# Altium project GameBoard_V1I1.PrjPcb (part 11 of 20)

## Sheet [30] - PWR PMIC.SchDoc
size A2; DocumentNumber: 29; SheetNumber: 29; SheetTotal: 32
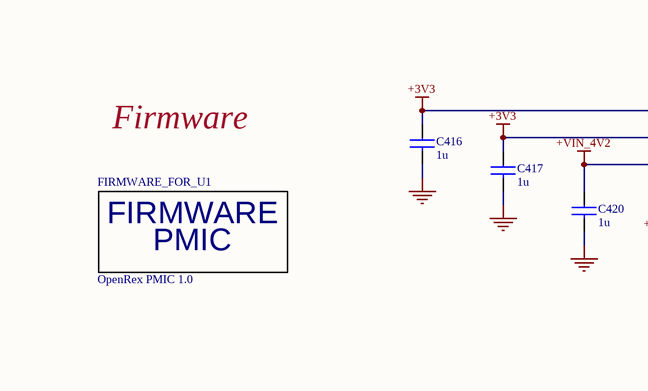
[diagram p62: [30] - PWR PMIC.SchDoc, top left]
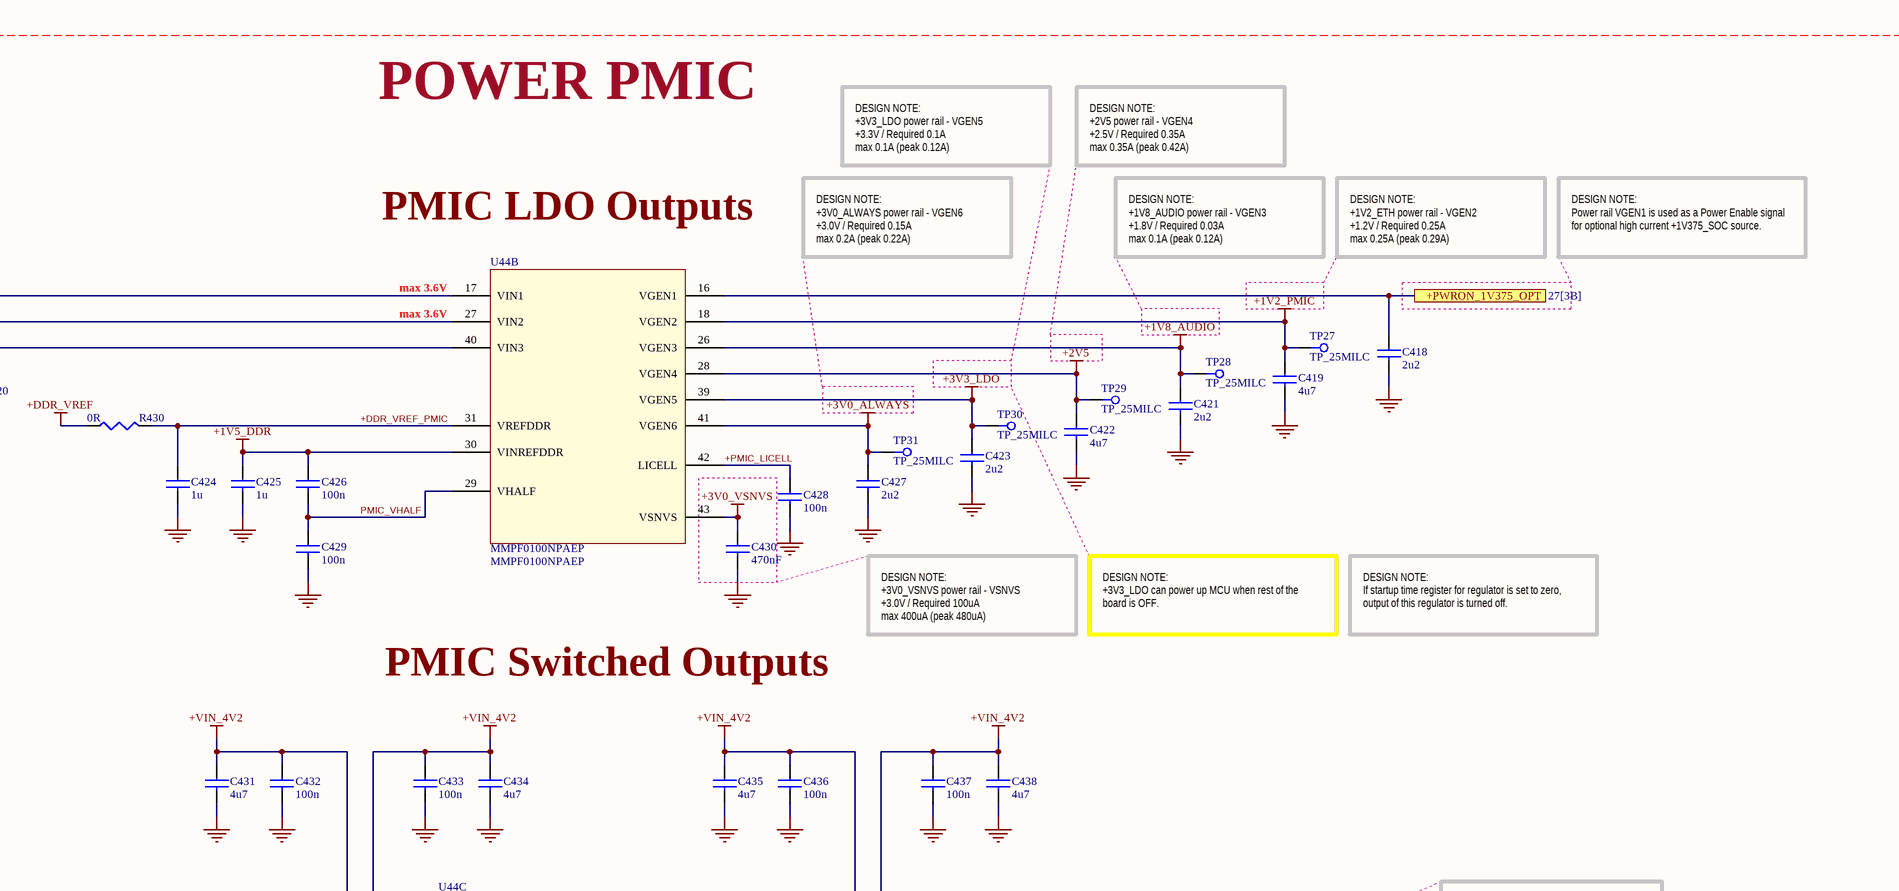
[diagram p63: [30] - PWR PMIC.SchDoc, top right]
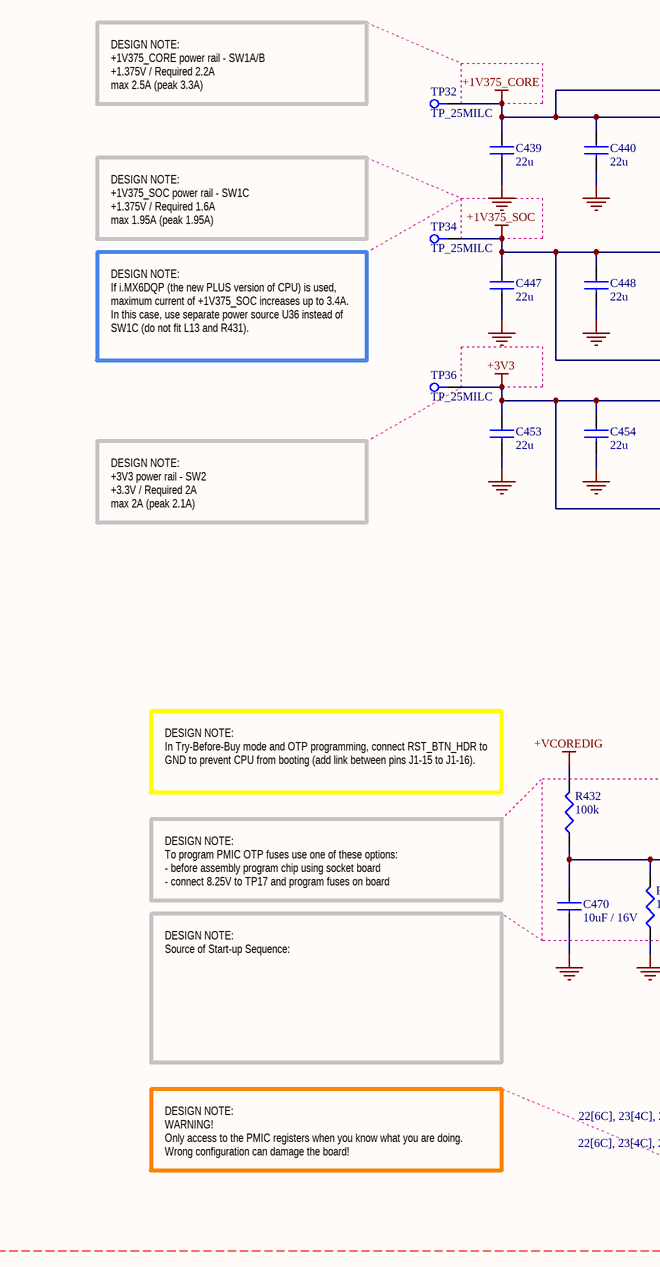
[diagram p64: [30] - PWR PMIC.SchDoc, bottom left]
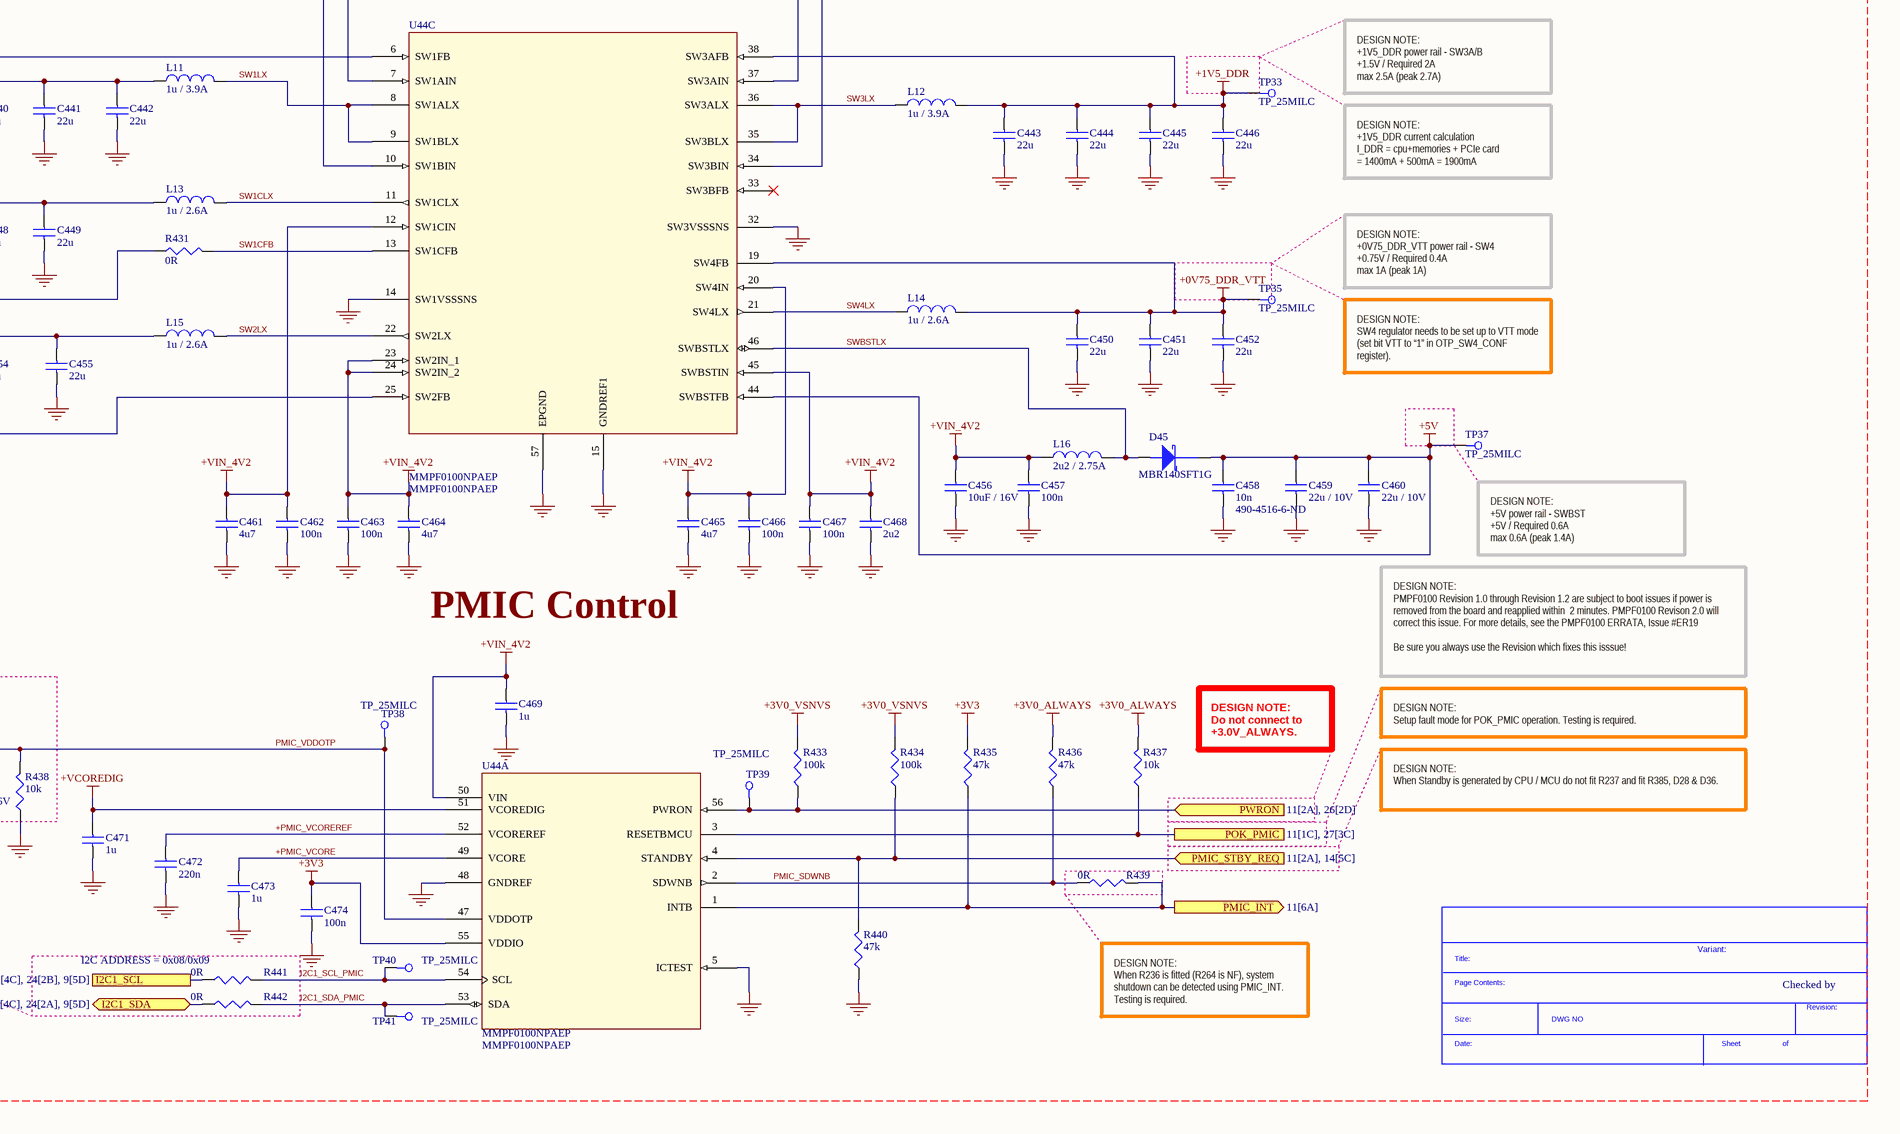
[diagram p65: [30] - PWR PMIC.SchDoc, bottom right]

### Parts
(Parts that share a designator on the sheet are numbered #1, #2 ... from top to bottom, then left to right.)
*#21  SDTitleBlock  (value not drawn)  (graphical)
C416  1u  [C0402]
C417  1u  [C0402]
C418  2u2  [C0402]
C419  4u7  [C0402]
C420  1u  [C0402]
C421  2u2  [C0402]
C422  4u7  [C0402]
C423  2u2  [C0402]
C424  1u  [C0402]
C425  1u  [C0402]
C426  100n  [C0402]
C427  2u2  [C0402]
C428  100n  [C0402]
C429  100n  [C0402]
C430  470nF  [C0402]
C431  4u7  [C0402]
C432  100n  [C0402]
C433  100n  [C0402]
C434  4u7  [C0402]
C435  4u7  [C0402]
C436  100n  [C0402]
C437  100n  [C0402]
C438  4u7  [C0402]
C439  22u  [C0603]
C440  22u  [C0603]
C441  22u  [C0603]
C442  22u  [C0603]
C443  22u  [C0603]
C444  22u  [C0603]
C445  22u  [C0603]
C446  22u  [C0603]
C447  22u  [C0603]
C448  22u  [C0603]
C449  22u  [C0603]
C450  22u  [C0603]
C451  22u  [C0603]
C452  22u  [C0603]
C453  22u  [C0603]
C454  22u  [C0603]
C455  22u  [C0603]
C456  10uF / 16V  [C0805]
C457  100n  [C0402]
C458  10n  Supplier Part Number 2: 490-4516-6-ND  [C0402]
C459  22u / 10V  [C0603]
C460  22u / 10V  [C0603]
C461  4u7  [C0402]
C462  100n  [C0402]
C463  100n  [C0402]
C464  4u7  [C0402]
C465  4u7  [C0402]
C466  100n  [C0402]
C467  100n  [C0402]
C468  2u2  [C0402]
C469  1u  [C0402]
C470  10uF / 16V  [C0805]
C471  1u  [C0402]
C472  220n  [C0402]
C473  1u  [C0402]
C474  100n  [C0402]
D45  MBR140SFT1G  [SOD-123FL]
FIRMWARE_FOR_U1  OpenRex PMIC 1.0  (mechanical)
L11  1u / 3.9A  [IHLP_118MILX144MIL]
L12  1u / 3.9A  [IHLP_118MILX144MIL]
L13  1u / 2.6A  [IFSC_79MILX98MIL]
L14  1u / 2.6A  [IFSC_79MILX98MIL]
L15  1u / 2.6A  [IFSC_79MILX98MIL]
L16  2u2 / 2.75A  [IHLP_160MILX175MIL]
R430  0R  [R0402]
R431  0R  [R0402]
R432  100k  [R0402]
R433  100k  [R0402]
R434  100k  [R0402]
R435  47k  [R0402]
R436  47k  [R0402]
R437  10k  [R0402]
R438  10k  [R0402]
R439  0R  [R0402]
R440  47k  [R0402]
R441  0R  [R0402]
R442  0R  [R0402]
TP27  TP_25MILC  [TP_25C]  (no BOM)
TP28  TP_25MILC  [TP_25C]  (no BOM)
TP29  TP_25MILC  [TP_25C]  (no BOM)
TP30  TP_25MILC  [TP_25C]  (no BOM)
TP31  TP_25MILC  [TP_25C]  (no BOM)
TP32  TP_25MILC  [TP_25C]  (no BOM)
TP33  TP_25MILC  [TP_25C]  (no BOM)
TP34  TP_25MILC  [TP_25C]  (no BOM)
TP35  TP_25MILC  [TP_25C]  (no BOM)
TP36  TP_25MILC  [TP_25C]  (no BOM)
TP37  TP_25MILC  [TP_25C]  (no BOM)
TP38  TP_25MILC  [TP_25C]  (no BOM)
TP39  TP_25MILC  [TP_25C]  (no BOM)
TP40  TP_25MILC  [TP_25C]  (no BOM)
TP41  TP_25MILC  [TP_25C]  (no BOM)
U44  MMPF0100NPAEP  [56-VFQFN EP]  (parts A,B,C of 3)

### Blocks framed on the sheet
I2C ADDRESS = 0x08/0x09: R441 R442

### Ports
+PWRON_1V375_OPT (see 27[3B]), I2C1_SCL (see 22[6C], 23[4C], 24[2B], 9[5D]), I2C1_SDA (bidir, see 22[6C], 23[4C], 24[2A], 9[5D]), PMIC_INT (out, see 11[6A]), PMIC_STBY_REQ (in, see 11[2A], 14[5C]), POK_PMIC (see 11[1C], 27[3C]), PWRON (in, see 11[2A], 26[2D])

### Nets
+0V75_DDR_VTT: C450.1 C451.1 C452.1 L14.2 TP35.1 U44.19(SW4FB)
+1V2_PMIC: C419.1 TP27.1 U44.18(VGEN2)
+1V5_DDR: C425.1 C426.1 C443.1 C444.1 C445.1 C446.1 L12.2 TP33.1 U44.30(VINREFDDR) U44.38(SW3AFB)
+1V8_AUDIO: C421.1 TP28.1 U44.26(VGEN3)
+1V375_CORE: C439.1 C440.1 C441.1 C442.1 L11.2 TP32.1 U44.6(SW1FB)
+1V375_SOC: C447.1 C448.1 C449.1 L13.1 R431.1 TP34.1
+2V5: C422.1 TP29.1 U44.28(VGEN4)
+3V0_ALWAYS: C427.1 R436.2 R437.2 TP31.1 U44.41(VGEN6)
+3V0_VSNVS: C430.1 R433.2 R434.2 U44.43(VSNVS)
+3V3: C416.1 C417.1 C453.1 C454.1 C455.1 C474.1 L15.2 R435.2 TP36.1 U44.17(VIN1) U44.25(SW2FB) U44.27(VIN2) U44.55(VDDIO)
+3V3_LDO: C423.1 TP30.1 U44.39(VGEN5)
+5V: C458.1 C459.1 C460.1 D45.1(Cathode) TP37.1 U44.44(SWBSTFB)
+DDR_VREF: R430.1
+VCOREDIG: C471.1 R432.2 U44.51(VCOREDIG)
+VIN_4V2: C420.1 C431.1 C432.1 C433.1 C434.1 C435.1 C436.1 C437.1 C438.1 C456.1 C457.1 C461.1 C462.1 C463.1 C464.1 C465.1 C466.1 C467.1 C468.1 C469.1 L16.1 U44.7(SW1AIN) U44.10(SW1BIN) U44.12(SW1CIN) U44.20(SW4IN) U44.23(SW2IN_1) U44.24(SW2IN_2) U44.34(SW3BIN) U44.37(SW3AIN) U44.40(VIN3) U44.45(SWBSTIN) U44.50(VIN)
GND: C416.2 C417.2 C418.2 C419.2 C420.2 C421.2 C422.2 C423.2 C424.2 C425.2 C427.2 C428.2 C429.2 C430.2 C431.2 C432.2 C433.2 C434.2 C435.2 C436.2 C437.2 C438.2 C439.2 C440.2 C441.2 C442.2 C443.2 C444.2 C445.2 C446.2 C447.2 C448.2 C449.2 C450.2 C451.2 C452.2 C453.2 C454.2 C455.2 C456.2 C457.2 C458.2 C459.2 C460.2 C461.2 C462.2 C463.2 C464.2 C465.2 C466.2 C467.2 C468.2 C469.2 C470.2 C471.2 C472.2 C473.2 C474.2 R438.1 R440.1 U44.5(ICTEST) U44.14(SW1VSSSNS) U44.15(GNDREF1) U44.32(SW3VSSSNS) U44.48(GNDREF) U44.57(EPGND)
+DDR_VREF_PMIC: C424.1 R430.2 U44.31(VREFDDR)
+PMIC_LICELL: C428.1 U44.42(LICELL)
+PMIC_VCORE: C473.1 U44.49(VCORE)
+PMIC_VCOREREF: C472.1 U44.52(VCOREREF)
+PWRON_1V375_OPT: C418.1 U44.16(VGEN1) ; port +PWRON_1V375_OPT
I2C1_SCL: R441.1 ; port I2C1_SCL
I2C1_SCL_PMIC: R441.2 TP40.1 U44.54(SCL)
I2C1_SDA: R442.1 ; port I2C1_SDA
I2C1_SDA_PMIC: R442.2 TP41.1 U44.53(SDA)
PMIC_INT: R435.1 R439.2 U44.1(INTB) ; port PMIC_INT
PMIC_SDWNB: R436.1 R439.1 U44.2(SDWNB)
PMIC_STBY_REQ: R434.1 R440.2 U44.4(STANDBY) ; port PMIC_STBY_REQ
PMIC_VDDOTP: C470.1 R432.1 R438.2 TP38.1 U44.47(VDDOTP)
PMIC_VHALF: C426.2 C429.1 U44.29(VHALF)
POK_PMIC: R437.1 U44.3(RESETBMCU) ; port POK_PMIC
PWRON: R433.1 TP39.1 U44.56(PWRON) ; port PWRON
SW1CFB: R431.2 U44.13(SW1CFB)
SW1CLX: L13.2 U44.11(SW1CLX)
SW1LX: L11.1 U44.8(SW1ALX) U44.9(SW1BLX)
SW2LX: L15.1 U44.22(SW2LX)
SW3LX: L12.1 U44.35(SW3BLX) U44.36(SW3ALX)
SW4LX: L14.1 U44.21(SW4LX)
SWBSTLX: D45.2(Anode) L16.2 U44.46(SWBSTLX)

Not connected (* = marked no-connect by the designer): U44 33(SW3BFB)*

### Layout directives
net class [29] - PWR PMIC: +0V75_DDR_VTT, +1V2_PMIC, +1V5_DDR, +1V8_AUDIO, +1V375_CORE, +1V375_SOC, +2V5, +3V0_ALWAYS, +3V0_VSNVS, +3V3, +3V3_LDO, +5V, +DDR_VREF, +DDR_VREF_PMIC, +PMIC_LICELL, +PMIC_VCORE, +PMIC_VCOREREF, +VCOREDIG, +VIN_4V2, GND, I2C1_SCL_PMIC, I2C1_SDA_PMIC, PMIC_SDWNB, PMIC_VDDOTP, PMIC_VHALF, SW1CFB, SW1CLX, SW1LX, SW2LX, SW3LX, SW4LX, SWBSTLX

### Notes on the sheet
- POWER PMIC
- DESIGN NOTE:
  +3V3_LDO power rail - VGEN5
  +3.3V / Required 0.1A
  max 0.1A (peak 0.12A)
- DESIGN NOTE:
  +2V5 power rail - VGEN4
  +2.5V / Required 0.35A
  max 0.35A (peak 0.42A)
- PMIC LDO Outputs
- DESIGN NOTE:
  +3V0_ALWAYS power rail - VGEN6
  +3.0V / Required 0.15A
  max 0.2A (peak 0.22A)
- DESIGN NOTE:
  +1V8_AUDIO power rail - VGEN3
  +1.8V / Required 0.03A
  max 0.1A (peak 0.12A)
- DESIGN NOTE:
  +1V2_ETH power rail - VGEN2
  +1.2V / Required 0.25A
  max 0.25A (peak 0.29A)
- (near U44) max 3.6V
- DESIGN NOTE:
  Power rail VGEN1 is used as a Power Enable signal for optional high current +1V375_SOC source.
- Firmware
- DESIGN NOTE:
  +3V0_VSNVS power rail - VSNVS
  +3.0V / Required 100uA
  max 400uA (peak 480uA)
- DESIGN NOTE:
  +3V3_LDO can power up MCU when rest of the board is OFF.
- DESIGN NOTE:
  If startup time register for regulator is set to zero, output of this regulator is turned off.
- PMIC Switched Outputs
- DESIGN NOTE:
  +1V375_CORE power rail - SW1A/B
  +1.375V / Required 2.2A
  max 2.5A (peak 3.3A)
- DESIGN NOTE:
  +1V5_DDR power rail - SW3A/B
  +1.5V / Required 2A
  max 2.5A (peak 2.7A)
- DESIGN NOTE:
  +1V375_SOC power rail - SW1C
  +1.375V / Required 1.6A
  max 1.95A (peak 1.95A)
- DESIGN NOTE:
  +1V5_DDR current calculation
  I_DDR = cpu+memories + PCIe card
  = 1400mA + 500mA = 1900mA
- DESIGN NOTE:
  +0V75_DDR_VTT power rail - SW4
  +0.75V / Required 0.4A
  max 1A (peak 1A)
- DESIGN NOTE:
  If i.MX6DQP (the new PLUS version of CPU) is used, maximum current of +1V375_SOC increases up to 3.4A.
  In this case, use separate power source U36 instead of SW1C (do not fit L13 and R431).
- DESIGN NOTE:
  SW4 regulator needs to be set up to VTT mode (set bit VTT to “1” in OTP_SW4_CONF register).
- DESIGN NOTE:
  +3V3 power rail - SW2
  +3.3V / Required 2A
  max 2A (peak 2.1A)
- DESIGN NOTE:
  +5V power rail - SWBST
  +5V / Required 0.6A
  max 0.6A (peak 1.4A)
- PMIC Control
- DESIGN NOTE:
  In Try-Before-Buy mode and OTP programming, connect RST_BTN_HDR to GND to prevent CPU from booting (add link between pins J1-15 to J1-16).
- DESIGN NOTE:
  PMPF0100 Revision 1.0 through Revision 1.2 are subject to boot issues if power is removed from the board and reapplied within  2 minutes. PMPF0100 Revison 2.0 will correct this issue. For more details, see the PMPF0100 ERRATA, Issue #ER19
  Be sure you always use the Revision which fixes this isssue!
- DESIGN NOTE:
  Do not connect to +3.0V_ALWAYS.
- DESIGN NOTE:
  Setup fault mode for POK_PMIC operation. Testing is required.
- DESIGN NOTE:
  To program PMIC OTP fuses use one of these options:
  - before assembly program chip using socket board
  - connect 8.25V to TP17 and program fuses on board
- DESIGN NOTE:
  When Standby is generated by CPU / MCU do not fit R237 and fit R385, D28 & D36.
- DESIGN NOTE:
  Source of Start-up Sequence:
- Variant:
- Checked by
- DESIGN NOTE:
  WARNING!
  Only access to the PMIC registers when you know what you are doing. Wrong configuration can damage the board!
- DESIGN NOTE:
  When R236 is fitted (R264 is NF), system shutdown can be detected using PMIC_INT. Testing is required.
- (in symbol FIRMWARE_OpenRex_PMIC_1.0) FIRMWARE; PMIC
- (in symbol SDTitleBlock) Title:; Page Contents:; Revision:; Size:; DWG NO; Date:; Sheet; of

### Library data of the parts
C416 C417 C420 C424 C425 C469 C471 C473 = C1005X5R1C105K: CAP CER 1.0UF 16V X5R 0402; Manufacturer: TDK Corporation; Capacitance: 1.0µF; Value: 1uF; .Checked PCB: used; Tolerance: ±10%; Category: Capacitors; Supplier Part Number: 445-4978-1-ND; Manufacturer Part Number: C1005X5R1C105K; Operating Temperature: -55°C ~ 85°C; Package / Case: 0402 (1005 Metric); Price 1k [$]: 0.02080; .Checked SCH: used; Voltage - Rated: 16V; Supplier: Digikey; Supplier 1: Digi-Key; Supplier Part Number 1: 445-4978-1-ND; RoHS: RoHS Compliant; Stock 1: 341010; Pricing 1: 1=0.24, 10=0.16, 100=0.064, 250=0.046, 500=0.0328, 1000=0.024 (USD); Temperature Coefficient: X5R; Mounting Type: Surface Mount, MLCC; Applications: General Purpose; Ratings: -; Size / Dimension: 0.039" L x 0.020" W (1.00mm x 0.50mm); Height - Seated (Max): -; Thickness (Max): 0.022" (0.55mm); Lead Spacing: -; Features: -; Packaging: Cut Tape (CT); Lead Style: -; ComponentLink1URL: http://www.tdk.co.jp/tefe02/e412_c.pdf; ComponentLink1Description: http://www.tdk.co.jp/tefe02/e412_c.pdf; Supplier 2: Digi-Key; Supplier Part Number 2: 445-13181-1-ND
C418 C421 C423 C427 C468 = C1005X5R1A225K: CAP CER 2.2UF 10V 10% X5R 0402; Manufacturer: TDK Corporation; Capacitance: 2.2µF; .Checked PCB: used; Supplier 1: Digi-Key; Supplier Part Number 1: 445-7392-1-ND; Manufacturer Part Number: C1005X5R1A225K; RoHS: RoHS Compliant; Category: Capacitors; Stock 1: 22891; Pricing 1: 1=0.42, 10=0.332, 100=0.2, 250=0.15, 500=0.128, 1000=0.1 (USD); Voltage - Rated: 10V; Tolerance: ±10%; Temperature Coefficient: X5R; Mounting Type: Surface Mount, MLCC; Operating Temperature: -55°C ~ 85°C; Applications: General Purpose; Ratings: -; Package / Case: 0402 (1005 Metric); Size / Dimension: 0.039" L x 0.020" W (1.00mm x 0.50mm); Height - Seated (Max): -; Thickness (Max): 0.022" (0.55mm); Lead Spacing: -; Features: -; Packaging: Cut Tape (CT); Lead Style: -; ComponentLink1URL: http://www.tdk.com/pdf/general_B11.pdf; ComponentLink1Description: http://www.tdk.com/pdf/general_B11.pdf; .Checked SCH: used; Supplier 2: Digi-Key; Supplier Part Number 2: 445-9090-1-ND
C419 C422 C431 C434 C435 C438 C461 C464 C465 = C1005X5R1A475M: CAP CER 4.7UF 10V 20% X5R 0402; Manufacturer: TDK Corporation; Capacitance: 4.7µF; .Checked PCB: used; Supplier 1: Digi-Key; Supplier Part Number 1: 445-8023-1-ND; Manufacturer Part Number: C1005X5R1A475M; RoHS: RoHS Compliant; Category: Capacitors; Stock 1: 10140; Pricing 1: 1=0.53, 10=0.415, 100=0.25, 250=0.18752, 500=0.16, 1000=0.125, 5000=0.095 (USD); Voltage - Rated: 10V; Tolerance: ±20%; Temperature Coefficient: X5R; Mounting Type: Surface Mount, MLCC; Operating Temperature: -55°C ~ 85°C; Applications: General Purpose; Ratings: -; Package / Case: 0402 (1005 Metric); Size / Dimension: 0.039" L x 0.020" W (1.00mm x 0.50mm); Height - Seated (Max): -; Thickness (Max): -; Lead Spacing: -; Features: -; Packaging: Cut Tape (CT); Lead Style: -; ComponentLink1URL: http://www.tdk.com/pdf/general_B11.pdf; ComponentLink1Description: http://www.tdk.com/pdf/general_B11.pdf; .Checked SCH: used
C426 C428 C429 C432 C433 C436 C437 C457 C462 C463 C466 C467 C474 = C1005X5R1H104K: CAP CER .10UF 50V X5R 10% 0402; Manufacturer: TDK Corporation; Capacitance: 0.1µF; Value: 100nF; .Checked PCB: used; Category: Capacitors; Supplier Part Number: 445-5942-1-ND; Manufacturer Part Number: C1005X5R1H104K; Operating Temperature: -55°C ~ 85°C; Package / Case: 0402 (1005 Metric); Price 1k [$]: 0.02340; .Checked SCH: used; Voltage - Rated: 50V; Supplier: Digikey; Supplier 1: Digi-Key; Supplier Part Number 1: 445-5942-1-ND; RoHS: RoHS Compliant; Stock 1: 106926; Pricing 1: 1=0.27, 10=0.18, 100=0.072, 250=0.05176, 500=0.0369, 1000=0.027 (USD); Tolerance: ±10%; Temperature Coefficient: X5R; Mounting Type: Surface Mount, MLCC; Applications: General Purpose; Ratings: -; Size / Dimension: 0.039" L x 0.020" W (1.00mm x 0.50mm); Height - Seated (Max): -; Thickness (Max): 0.022" (0.55mm); Lead Spacing: -; Features: -; Packaging: Cut Tape (CT); Lead Style: -; ComponentLink1URL: http://www.tdk.co.jp/tefe02/e412_c.pdf; ComponentLink1Description: http://www.tdk.co.jp/tefe02/e412_c.pdf; Supplier 2: Digi-Key; Supplier Part Number 2: 311-1697-6-ND
C430 = C1005X5R1C474K: CAP CER .47UF 16V X5R 0402; Manufacturer: TDK Corporation; Capacitance: 0.47µF; .Checked PCB: used; Tolerance: ±10%; Category: Capacitors; Supplier Part Number: 445-4976-1-ND; Manufacturer Part Number: C1005X5R1C474K; Operating Temperature: -55°C ~ 85°C; Package / Case: 0402 (1005 Metric); Price 1k [$]: 0.02400; Value: 470nF; .Checked SCH: used; Voltage - Rated: 16V; Supplier: Digikey; Supplier 1: Digi-Key; Supplier Part Number 1: 445-4976-1-ND; RoHS: RoHS Compliant; Stock 1: 141502; Pricing 1: 1=0.24, 10=0.16, 100=0.064, 250=0.046, 500=0.0328, 1000=0.024 (USD); Temperature Coefficient: X5R; Mounting Type: Surface Mount, MLCC; Applications: General Purpose; Ratings: -; Size / Dimension: 0.039" L x 0.020" W (1.00mm x 0.50mm); Height - Seated (Max): -; Thickness (Max): 0.022" (0.55mm); Lead Spacing: -; Features: -; Packaging: Cut Tape (CT); Lead Style: -; ComponentLink1URL: http://www.tdk.co.jp/tefe02/e412_c.pdf; ComponentLink1Description: http://www.tdk.co.jp/tefe02/e412_c.pdf; Supplier 2: Digi-Key; Supplier Part Number 2: 1276-1173-6-ND
C439-C452 = GRM188R60G226MEA0L: CAP CER 22UF 4V 20% X5R 0603; Manufacturer: Murata Electronics North America; Capacitance: 22µF; .Checked PCB: used; .Creator: MM; Supplier 1: Digi-Key; Supplier Part Number 1: 490-5526-1-ND; Manufacturer Part Number: GRM188R60G226MEA0L; RoHS: RoHS Compliant; Category: Capacitors; Stock 1: 5760; Pricing 1: 1=0.79, 10=0.663, 50=0.4752, 100=0.4158, 250=0.32672, 500=0.297, 1000=0.2376 (USD); Voltage - Rated: 4V; Tolerance: ±20%; Temperature Coefficient: X5R; Mounting Type: Surface Mount, MLCC; Operating Temperature: -55°C ~ 85°C; Applications: General Purpose; Ratings: -; Package / Case: 0603 (1608 Metric); Size / Dimension: 0.063" L x 0.031" W (1.60mm x 0.80mm); Height - Seated (Max): -; Thickness (Max): 0.035" (0.90mm); Lead Spacing: -; Features: -; Packaging: Cut Tape (CT); Lead Style: -; ComponentLink1URL: http://www.murata.com/products/catalog/pdf/c02e.pdf; ComponentLink1Description: http://www.murata.com/products/catalog/pdf/c02e.pdf; .Checked SCH: used
C453-C455 = C1608X5R0J226M080AC: CAP CER 22UF 6.3V 20% X5R 0603; Manufacturer: TDK Corporation; Capacitance: 22µF; .Creator: MM; .Checked PCB: used; Supplier 1: Digi-Key; Manufacturer Part Number: C1608X5R0J226M080AC; RoHS: RoHS Compliant; Category: Capacitors; Stock 1: 593047; Pricing 1: 1=0.39, 10=0.343, 100=0.1714, 250=0.13708, 500=0.12484, 1000=0.1104 (USD); Packaging: Cut Tape (CT); Tolerance: ±20%; Voltage - Rated: 6.3V; Temperature Coefficient: X5R; Mounting Type: Surface Mount, MLCC; Operating Temperature: -55°C ~ 85°C; Applications: General Purpose; Ratings: -; Package / Case: 0603 (1608 Metric); Size / Dimension: 0.063" L x 0.031" W (1.60mm x 0.80mm); Height - Seated (Max): -; Thickness (Max): 0.039" (1.00mm); Lead Spacing: -; Features: -; Lead Style: -; ComponentLink1URL: http://product.tdk.com/en/catalog/datasheets/mlcc_commercial_general_en.pdf; ComponentLink1Description: http://product.tdk.com/en/catalog/datasheets/mlcc_commercial_general_en.pdf; Supplier Part Number 1: 445-8028-1-ND; .Checked SCH: used
C456 C470 = C2012X5R1C106M: CAP CER 10UF 16V 20% X5R 0805; Manufacturer: TDK Corporation; Manufacturer Part Number: C2012X5R1C106M/1.25; Capacitance: 10µF; .Checked PCB: used; Supplier 1: Digi-Key; Supplier Part Number 1: 445-5984-1-ND; RoHS: RoHS Compliant; Category: Capacitors; Voltage - Rated: 16V; Tolerance: ±20%; Temperature Coefficient: X5R; Mounting Type: Surface Mount, MLCC; Operating Temperature: -55°C ~ 85°C; Applications: General Purpose; Ratings: -; Package / Case: 0805 (2012 Metric); Size / Dimension: 0.079" L x 0.049" W (2.00mm x 1.25mm); Height - Seated (Max): -; Thickness (Max): 0.039" (1.00mm); Lead Spacing: -; Features: -; Packaging: Cut Tape (CT); Lead Style: -; ComponentLink1URL: http://www.tdk.com/pdf/general_B11.pdf; ComponentLink1Description: http://www.tdk.com/pdf/general_B11.pdf; .Checked SCH: used; Supplier 2: Digi-Key; Supplier Part Number 2: 478-10492-1-ND
C458 = C1005X7R1H103K: CAP CER 10000PF 50V 10% X7R 0402; Manufacturer: TDK Corporation; Value: 10nF; .Checked PCB: used; Capacitance: 10000pF; Category: Capacitors; Supplier Part Number: 445-6850-1-ND; Manufacturer Part Number: C1005X7R1H103K; Operating Temperature: -55°C ~ 125°C; Package / Case: 0402 (1005 Metric); Price 1k [$]: 0.01625; .Checked SCH: used; Voltage - Rated: 50V; Supplier: Digikey; Supplier 1: Digi-Key; Supplier Part Number 1: 445-6850-1-ND; RoHS: RoHS Compliant; Stock 1: 3901; Pricing 1: 1=0.2, 10=0.125, 100=0.045, 250=0.03252, 500=0.024, 1000=0.01625 (USD); Tolerance: ±10%; Temperature Coefficient: X7R; Mounting Type: Surface Mount, MLCC; Applications: General Purpose; Ratings: -; Size / Dimension: 0.039" L x 0.020" W (1.00mm x 0.50mm); Height - Seated (Max): -; Thickness (Max): 0.022" (0.55mm); Lead Spacing: -; Features: -; Packaging: Cut Tape (CT); Lead Style: -; ComponentLink1URL: http://www.tdk.co.jp/tefe02/e412_c.pdf; ComponentLink1Description: http://www.tdk.co.jp/tefe02/e412_c.pdf; Supplier 2: Digi-Key
C459 C460 = C1608X5R1A226M080AC: CAP CER 22UF 10V X5R 0603; Manufacturer: TDK Corporation; Capacitance: 22µF; Tolerance: ±20%; .Creator: MM; .Checked SCH: used; Supplier 1: Digi-Key; Manufacturer Part Number: C1608X5R1A226M080AC; RoHS: RoHS Compliant; Category: Capacitors; Stock 1: 405620; Pricing 1: 1=0.49, 10=0.469, 100=0.2275, 250=0.189, 500=0.1715, 1000=0.1575 (USD); Packaging: Cut Tape (CT); Voltage - Rated: 10V; Temperature Coefficient: X5R; Mounting Type: Surface Mount, MLCC; Operating Temperature: -55°C ~ 85°C; Applications: General Purpose; Ratings: -; Package / Case: 0603 (1608 Metric); Size / Dimension: 0.063" L x 0.031" W (1.60mm x 0.80mm); Height - Seated (Max): -; Thickness (Max): 0.035" (0.90mm); Lead Spacing: -; Features: -; Lead Style: -; ComponentLink1URL: http://product.tdk.com/en/catalog/datasheets/mlcc_commercial_general_en.pdf; ComponentLink1Description: http://product.tdk.com/en/catalog/datasheets/mlcc_commercial_general_en.pdf; Supplier Part Number 1: 445-9077-1-ND; .Checked PCB: used; Supplier 2: Digi-Key; Supplier Part Number 2: 1276-1274-1-ND
C472 = C1005X5R1E224M: CAP CER .22UF 25V X5R 20% 0402; Manufacturer: TDK Corporation; Capacitance: 0.22µF; Value: 220nF; .Checked PCB: used; Category: Capacitors; Supplier Part Number: 445-5945-1-ND; Manufacturer Part Number: C1005X5R1E224M; Operating Temperature: -55°C ~ 85°C; Package / Case: 0402 (1005 Metric); Price 1k [$]: 0.02600; .Checked SCH: used; Voltage - Rated: 25V; Supplier: Digikey; Supplier 1: Digi-Key; Supplier Part Number 1: 445-5945-1-ND; RoHS: RoHS Compliant; Stock 1: 54593; Pricing 1: 1=0.3, 10=0.2, 100=0.08, 250=0.05752, 500=0.041, 1000=0.03 (USD); Tolerance: ±20%; Temperature Coefficient: X5R; Mounting Type: Surface Mount, MLCC; Applications: General Purpose; Ratings: -; Size / Dimension: 0.039" L x 0.020" W (1.00mm x 0.50mm); Height - Seated (Max): -; Thickness (Max): 0.022" (0.55mm); Lead Spacing: -; Features: -; Packaging: Cut Tape (CT); Lead Style: -; ComponentLink1URL: http://www.tdk.co.jp/tefe02/e412_c.pdf; ComponentLink1Description: http://www.tdk.co.jp/tefe02/e412_c.pdf; Supplier 2: Digi-Key; Supplier Part Number 2: 587-1452-1-ND
D45 = MBR140SFT1G: DIODE SCHOTTKY 40V 1A SOD123L; Manufacturer: ON Semiconductor; Voltage - Forward (Vf) (Max) @ If: 550mV @ 1A; Speed: Fast Recovery =< 500ns, > 200mA (Io); Current - Reverse Leakage @ Vr: 500µA @ 40V; .Creator: MM; .Checked PCB: used; Supplier 1: Digi-Key; Manufacturer Part Number: MBR140SFT1G; RoHS: RoHS Compliant; Category: Discrete Semiconductor Products; Stock 1: 9727; Pricing 1: 1=0.47, 10=0.333, 25=0.274, 100=0.2188, 250=0.1594, 500=0.12944, 1000=0.0995 (USD); Packaging: Cut Tape (CT); Diode Type: Schottky; Voltage - DC Reverse (Vr) (Max): 40V; Current - Average Rectified (Io): 1A; Reverse Recovery Time (trr): -; Capacitance @ Vr, F: -; Mounting Type: Surface Mount; Package / Case: SOD-123F; Supplier Device Package: SOD-123L; Operating Temperature - Junction: -55°C ~ 125°C; ComponentLink1URL: http://www.onsemi.com/pub_link/Collateral/MBR140SFT1-D.PDF; ComponentLink1Description: http://www.onsemi.com/pub_link/Collateral/MBR140SFT1-D.PDF; Supplier Part Number 1: MBR140SFT1GOSCT-ND; .Checked SCH: used
FIRMWARE_FOR_U1 = FIRMWARE_OpenRex_PMIC_1.0: .Creator: MM; .Checked PCB: used; Category: Firmware; .Checked SCH: used
L11 L12 = IHLP1212AEER1R0M11: FIXED IND 1UH 3.9A 33 MOHM SMD; Manufacturer: Vishay Dale; Type: Molded; Inductance: 1µH; Tolerance: ±20%; Current - Saturation: 5.3A; Shielding: Shielded; DC Resistance (DCR): 33 mOhm Max; Frequency - Test: 100kHz; .Creator: MM; .Checked PCB: used; Supplier 1: Digi-Key; Manufacturer Part Number: IHLP1212AEER1R0M11; RoHS: RoHS Compliant; Category: Inductors, Coils, Chokes; Stock 1: 3480; Pricing 1: 1=1.44, 10=1.35, 100=1.026, 500=0.828, 1000=0.756 (USD); Packaging: Cut Tape (CT); Material - Core: -; Current Rating: 3.9A; Q @ Freq: -; Frequency - Self Resonant: -; Operating Temperature: -55°C ~ 125°C; Mounting Type: Surface Mount; Package / Case: Nonstandard; Size / Dimension: 0.144" L x 0.118" W (3.65mm x 3.00mm); Height - Seated (Max): 0.047" (1.20mm); Supplier Device Package: -; ComponentLink1URL: http://www.vishay.com/docs/34300/lp12ae11.pdf; ComponentLink1Description: http://www.vishay.com/docs/34300/lp12ae11.pdf; Supplier Part Number 1: 541-1327-1-ND; .Checked SCH: used
L13-L15 = IFSC1008ABER1R0M01: FIXED IND 1UH 2.6A 43 MOHM SMD; Manufacturer: Vishay Dale; Inductance: 1µH; Tolerance: ±20%; Current - Saturation: 2.7A; Shielding: Shielded; DC Resistance (DCR): 43 mOhm Max; Frequency - Test: 100kHz; .Creator: MM; .Checked PCB: used; Supplier 1: Digi-Key; Manufacturer Part Number: IFSC1008ABER1R0M01; RoHS: RoHS Compliant; Category: Inductors, Coils, Chokes; Stock 1: 46148; Pricing 1: 1=0.62, 10=0.501, 100=0.4175, 500=0.334, 1000=0.3006 (USD); Packaging: Cut Tape (CT); Type: -; Material - Core: -; Current Rating: 2.6A; Q @ Freq: -; Frequency - Self Resonant: -; Operating Temperature: -55°C ~ 125°C; Mounting Type: Surface Mount; Package / Case: Nonstandard; Size / Dimension: 0.098" L x 0.079" W (2.50mm x 2.00mm); Height - Seated (Max): 0.047" (1.20mm); Supplier Device Package: -; ComponentLink1URL: http://www.vishay.com/docs/34294/s108ab01.pdf; ComponentLink1Description: http://www.vishay.com/docs/34294/s108ab01.pdf; Supplier Part Number 1: 541-1388-1-ND; .Checked SCH: used
L16 = IHLP1616ABER2R2M11: FIXED IND 2.2UH 2.75A 83.5 MOHM; Manufacturer: Vishay Dale; Type: Molded; Inductance: 2.2µH; Tolerance: ±20%; Current - Saturation: 3A; Shielding: Shielded; DC Resistance (DCR): 83.5 mOhm Max; Frequency - Self Resonant: 49MHz; Frequency - Test: 100kHz; .Creator: MM; .Checked PCB: used; Supplier 1: Digi-Key; Manufacturer Part Number: IHLP1616ABER2R2M11; RoHS: RoHS Compliant; Category: Inductors, Coils, Chokes; Stock 1: 11070; Pricing 1: 1=2.63, 10=2.45, 100=1.82, 500=1.54, 1000=1.435 (USD); Packaging: Cut Tape (CT); Material - Core: -; Current Rating: 2.75A; Q @ Freq: -; Operating Temperature: -55°C ~ 125°C; Mounting Type: Surface Mount; Package / Case: Nonstandard; Size / Dimension: 0.175" L x 0.160" W (4.45mm x 4.06mm); Height - Seated (Max): 0.047" (1.20mm); Supplier Device Package: -; ComponentLink1URL: http://media.digikey.com/pdf/Data%20Sheets/Vishay%20Dale%20PDFs/IHLP-1616-11.pdf; ComponentLink1Description: http://media.digikey.com/pdf/Data%20Sheets/Vishay%20Dale%20PDFs/IHLP-1616-11.pdf; Supplier Part Number 1: 541-1045-1-ND; .Checked SCH: used
R430 R431 R439 R441 R442 = RC0402JR-070RL: RES 0.0 OHM 1/16W 0402 SMD; Manufacturer: Yageo; Resistance (Ohms): 0.0; Power (Watts): 0.063W, 1/16W; Tolerance: Jumper; .Checked PCB: used; Category: Resistors; Supplier Part Number: 311-0.0JRCT-ND; Manufacturer Part Number: RC0402JR-070RL; Package / Case: 0402 (1005 Metric); Price 1k [$]: 0.01389; Value: 0R; .Checked SCH: used; Supplier: Digikey; Supplier 1: Digi-Key; Supplier Part Number 1: 311-0.0JRCT-ND; RoHS: RoHS Compliant; Stock 1: 1106330; Pricing 1: 10=0.012, 50=0.009, 100=0.0069, 250=0.00512, 500=0.0038, 1000=0.00253 (USD); Composition: Thick Film; Features: -; Temperature Coefficient: -; Size / Dimension: 0.039" L x 0.020" W (1.00mm x 0.50mm); Height: 0.016" (0.40mm); Number of Terminations: 2; Packaging: Cut Tape (CT); ComponentLink1URL: http://www.yageo.com/documents/recent/PYu-RC0402_51_RoHS_L_6.pdf; ComponentLink1Description: http://www.yageo.com/documents/recent/PYu-RC0402_51_RoHS_L_6.pdf
R432-R434 = RMCF0402FT100K: RES 100K OHM 1/16W 1% 0402 SMD; Manufacturer: Stackpole Electronics Inc; Power (Watts): 0.063W, 1/16W; .Checked PCB: used; Temperature Coefficient: ±100ppm/°C; Category: Resistors; Supplier Part Number: RMCF0402FT100KCT-ND; Manufacturer Part Number: RMCF0402FT100K; Package / Case: 0402 (1005 Metric); Price 1k [$]: 0.00384; Resistance (Ohms): 100K; Tolerance: ±1%; Value: 100k; .Checked SCH: used; Supplier: Digikey; Supplier 1: Digi-Key; Supplier Part Number 1: YAG1343DKR-ND; RoHS: RoHS Compliant; Composition: Thick Film; Features: -; Size / Dimension: 0.039" L x 0.020" W (1.00mm x 0.50mm); Height: 0.016" (0.40mm); Number of Terminations: 2; Packaging: Cut Tape (CT); ComponentLink1URL: http://www.seielect.com/Catalog/SEI-RMCF.pdf; ComponentLink1Description: http://www.seielect.com/Catalog/SEI-RMCF.pdf
R435 R436 R440 = RC0402FR-0747KL: RES 47.0K OHM 1/16W 1% 0402 SMD; Manufacturer: Yageo; Power (Watts): 0.063W, 1/16W; .Checked PCB: used; Temperature Coefficient: ±100ppm/°C; Category: Resistors; Supplier Part Number: 311-47.0KLRCT-ND; Manufacturer Part Number: RC0402FR-0747KL; Package / Case: 0402 (1005 Metric); Price 1k [$]: 0.01421; Resistance (Ohms): 47K; Tolerance: ±1%; Value: 47k; .Checked SCH: used; Supplier: Digikey; Supplier 1: Digi-Key; Supplier Part Number 1: 311-47.0KLRCT-ND; RoHS: RoHS Compliant; Stock 1: 1227580; Pricing 1: 10=0.014, 50=0.0104, 100=0.0079, 250=0.00584, 500=0.00432, 1000=0.00288 (USD); Composition: Thick Film; Features: -; Size / Dimension: 0.039" L x 0.020" W (1.00mm x 0.50mm); Height: 0.016" (0.40mm); Number of Terminations: 2; Packaging: Cut Tape (CT); ComponentLink1URL: http://www.yageo.com/documents/recent/PYu-RC0402_51_RoHS_L_6.pdf; ComponentLink1Description: http://www.yageo.com/documents/recent/PYu-RC0402_51_RoHS_L_6.pdf; Supplier 2: Digi-Key; Supplier Part Number 2: 1276-3467-1-ND
R437 R438 = RC0402FR-0710KL: RES 10.0K OHM 1/16W 1% 0402 SMD; Manufacturer: Yageo; Power (Watts): 0.063W, 1/16W; .Checked PCB: used; Temperature Coefficient: ±100ppm/°C; Category: Resistors; Supplier Part Number: 311-10.0KLRCT-ND; Manufacturer Part Number: RC0402FR-0710KL; Package / Case: 0402 (1005 Metric); Price 1k [$]: 0.01421; Resistance (Ohms): 10K; Tolerance: ±1%; Value: 10k; .Checked SCH: used; Supplier: Digikey; Supplier 1: Digi-Key; Supplier Part Number 1: 311-10.0KLRCT-ND; RoHS: RoHS Compliant; Stock 1: 2916495; Pricing 1: 10=0.014, 50=0.0104, 100=0.0079, 250=0.00584, 500=0.00432, 1000=0.00288 (USD); Composition: Thick Film; Features: -; Size / Dimension: 0.039" L x 0.020" W (1.00mm x 0.50mm); Height: 0.016" (0.40mm); Number of Terminations: 2; Packaging: Cut Tape (CT); ComponentLink1URL: http://www.yageo.com/documents/recent/PYu-RC0402_51_RoHS_L_6.pdf; ComponentLink1Description: http://www.yageo.com/documents/recent/PYu-RC0402_51_RoHS_L_6.pdf
TP27-TP41 = TP_25MILC: Test Point 25mil; .Checked PCB: used
U44 = MMPF0100NPAEP: IC PWR MGMT I.MX6 56QFN; Manufacturer: Freescale Semiconductor; Voltage - Input: 2.8 V ~ 4.5 V; Number of Outputs: 12; Voltage - Output: Multiple; .Creator: MM; .Checked PCB: used; Supplier 1: Digi-Key; Manufacturer Part Number: MMPF0100NPAEP; RoHS: RoHS Compliant; Category: Integrated Circuits (ICs); Stock 1: 0; Pricing 1: 260=4.017 (USD); Packaging: Tray; Applications: Converter, i.MX6; Operating Temperature: -40°C ~ 85°C; Mounting Type: Surface Mount; Package / Case: 56-VFQFN Exposed Pad; Supplier Device Package: 56-QFN (8x8); ComponentLink1URL: http://cache.freescale.com/files/analog/doc/data_sheet/MMPF0100.pdf; ComponentLink1Description: http://cache.freescale.com/files/analog/doc/data_sheet/MMPF0100.pdf; Supplier Part Number 1: MMPF0100NPAEP-ND; .Checked SCH: used; Supplier 2: Arrow; Supplier Part Number 2: MMPF0100NPAEP